# EAGLE design PIC32Schematic (EAGLE 5.12)
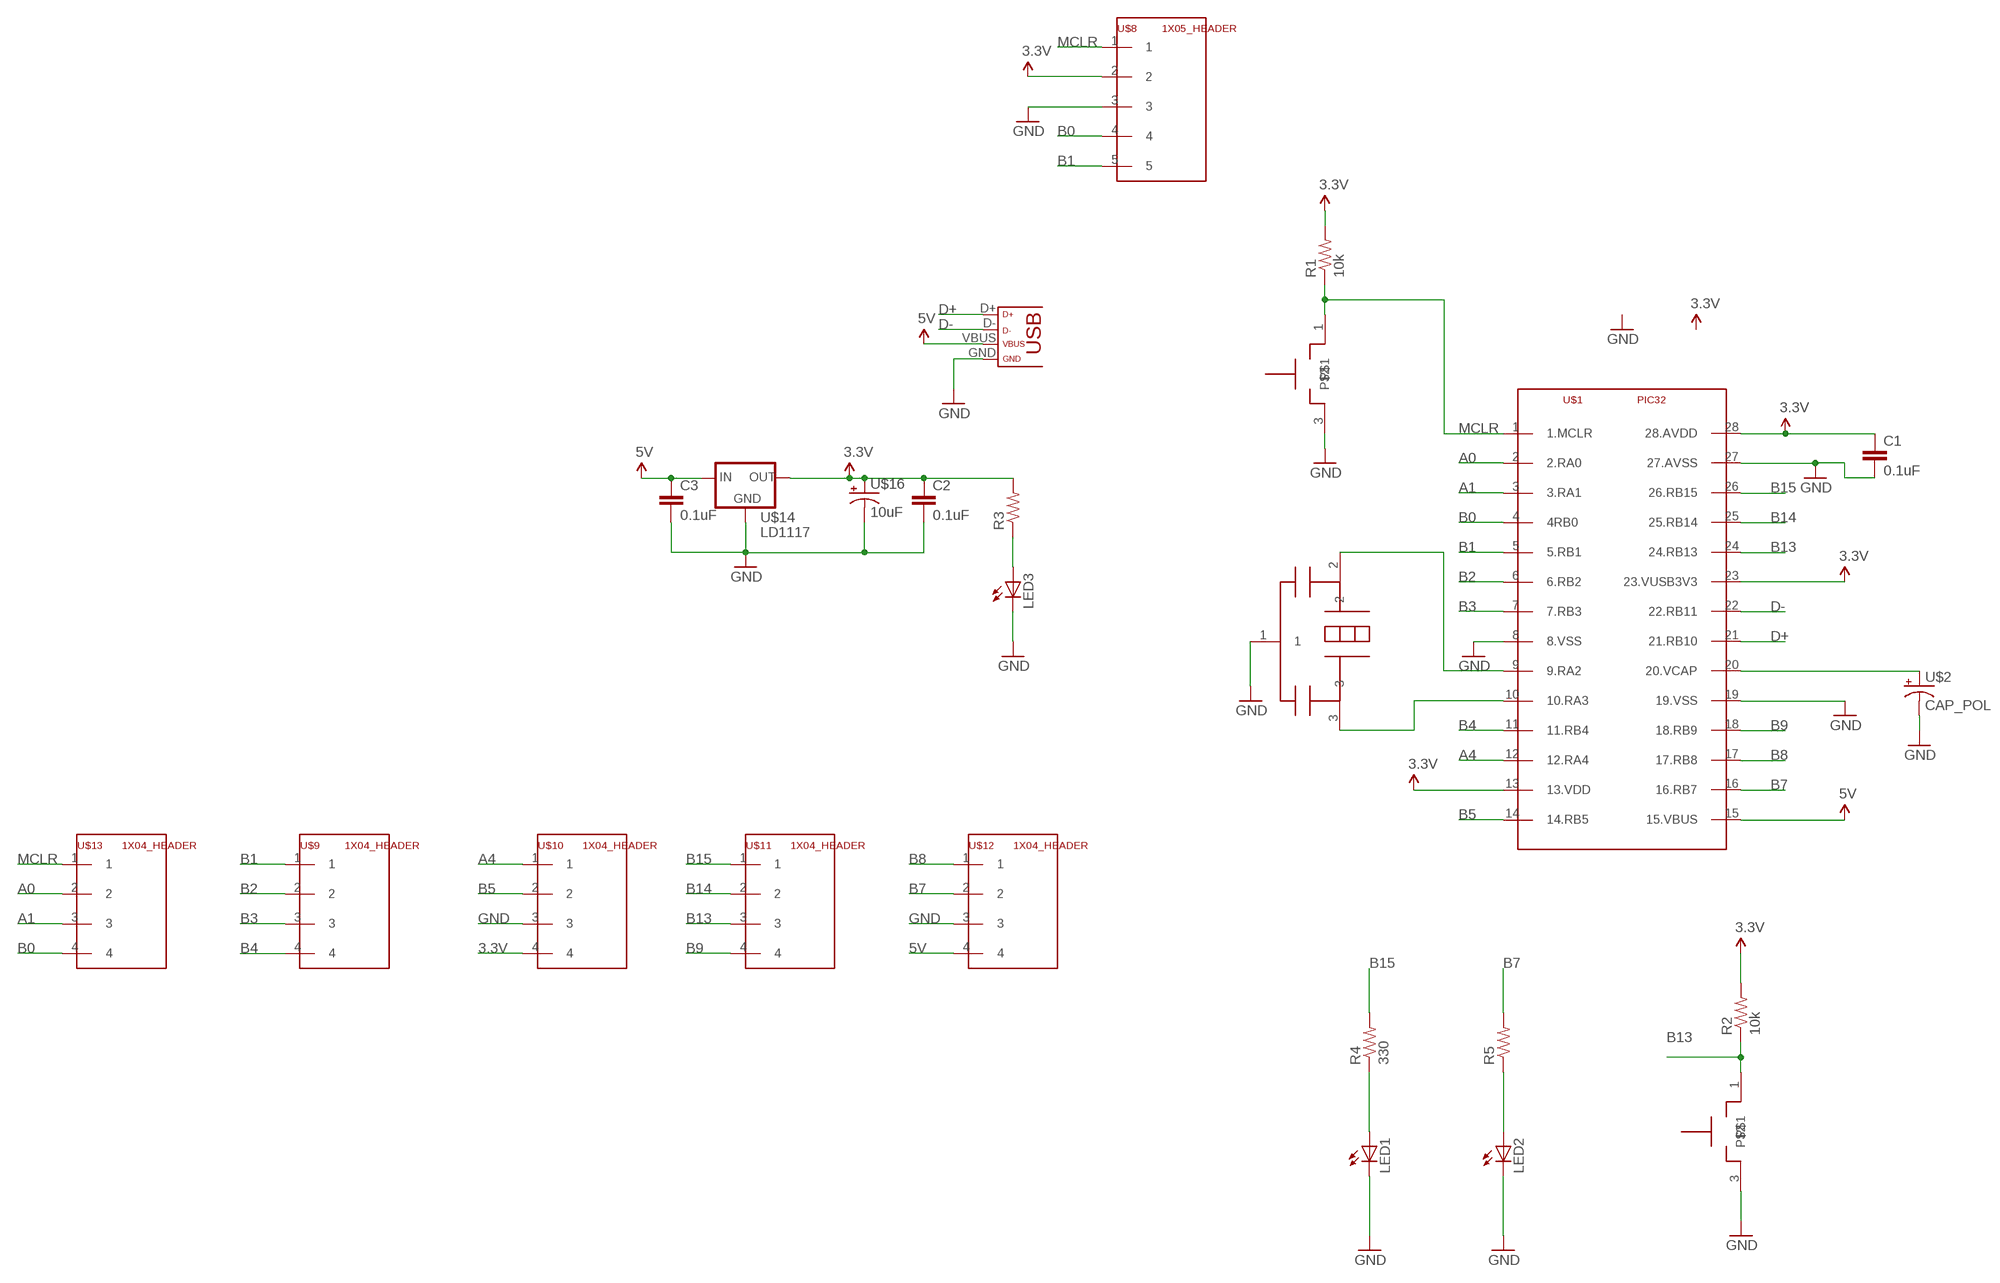
[diagram p0: schematic, sheet 1]

## Parts
8MHZ  RESONATER  [1X03]
C1  0.1uF  C-EU025-024X044  [C025-024X044]
C2  0.1uF  C-EU025-024X044  [C025-024X044]
C3  0.1uF  C-EU025-024X044  [C025-024X044]
LED1  LED3MM  [LED3MM]
LED2  LED3MM  [LED3MM]
LED3  LED3MM  [LED3MM]
R1  10k  R-US_0204/7  [0204/7]
R2  10k  R-US_0204/7  [0204/7]
R3  R-US_0204/7  [0204/7]
R4  330  R-US_0204/7  [0204/7]
R5  R-US_0204/7  [0204/7]
RESET  PUSHBUTTON  [1X03]
U$1  PIC32  [DIL28-3]
U$2  CAP_POL  [CAP_POL_D]
U$5  PUSHBUTTON  [1X03]
U$6  USB  [USB-MINIB]
U$8  1X05_HEADER  [1X05]
U$9  1X04_HEADER  [1X04]
U$10  1X04_HEADER  [1X04]
U$11  1X04_HEADER  [1X04]
U$12  1X04_HEADER  [1X04]
U$13  1X04_HEADER  [1X04]
U$14  LD1117  [TO220]
U$16  10uF  CAP_POL  [CAP_POL_D]

## Nets
3.3V: C1.1 C2.1 R1.2 R2.2 R3.2 U$1.13(13.VDD) U$1.23(23.VUSB3V3) U$1.28(28.AVDD) U$8.2 U$10.4 U$14.2(OUT) U$16.1(+)
5V: C3.1 U$1.15(15.VBUS) U$6.VBUS U$12.4 U$14.3(IN)
A0: U$1.2(2.RA0) U$13.2
A1: U$1.3(3.RA1) U$13.3
A4: U$1.12(12.RA4) U$10.1
B0: U$1.4(4RB0) U$8.4 U$13.4
B1: U$1.5(5.RB1) U$8.5 U$9.1
B2: U$1.6(6.RB2) U$9.2
B3: U$1.7(7.RB3) U$9.3
B4: U$1.11(11.RB4) U$9.4
B5: U$1.14(14.RB5) U$10.2
B7: R5.2 U$1.16(16.RB7) U$12.2
B8: U$1.17(17.RB8) U$12.1
B9: U$1.18(18.RB9) U$11.4
B13: R2.1 U$1.24(24.RB13) U$5.1 U$11.3
B14: U$1.25(25.RB14) U$11.2
B15: R4.2 U$1.26(26.RB15) U$11.1
D+: U$1.21(21.RB10) U$6.D+
D-: U$1.22(22.RB11) U$6.D-
GND: 8MHZ.1 C1.2 C2.2 C3.2 LED1.K(C) LED2.K(C) LED3.K(C) RESET.3 U$1.8(8.VSS) U$1.19(19.VSS) U$1.27(27.AVSS) U$2.2(-) U$5.3 U$6.GND U$8.3 U$10.3 U$12.3 U$14.1(GND) U$16.2(-)
MCLR: R1.1 RESET.1 U$1.1(1.MCLR) U$8.1 U$13.1
N$6: U$1.20(20.VCAP) U$2.1(+)
N$13: 8MHZ.3 U$1.10(10.RA3)
N$14: 8MHZ.2 U$1.9(9.RA2)
N$23: LED2.A R5.1
N$24: LED1.A R4.1
N$51: LED3.A R3.1

## Library data of the parts
8MHZ = ME433:RESONATER
C1-C3 = ME433:C-EU: CAPACITOR, European symbol
LED1-LED3 = ME433:LED: LED OSRAM: - CHIPLED LG R971, LG N971, LY N971, LG Q971, LY Q971, LO R971, LY R971 LH N974, LH R974 LS Q976, LO Q976, LY Q976 LO Q996 - Hyper CHIPLED LW Q18S LB Q993, LB Q99A, LB R99A - SideLED LS A670, LO A670, LY A670, LG A670, LP A670 LB A673, LV A673, LT A673, LW A673 LH A674 LY A675 LS A676, LA A676, LO A676, LY A676, LW A676 LS A679, LY A679, LG A679 - Hyper Micro SIDELED® LS Y876, LA Y876, LO Y876, LY Y876 LT Y87S - SmartLED LW L88C, LW L88S LB L89C, LB L89S, LG L890 LS L89K, LO L89K, LY L89K LS L896, LA L896, LO L896, LY L896 - TOPLED LS T670, LO T670, LY T670, LG T670, LP T670 LSG T670, LSP T670, LSY T670, LOP T670, LYG T670 LG T671, LOG T671, LSG T671 LB T673, LV T673, LT T673, LW T673 LH T674 LS T676, LA T676, LO T676, LY T676, LB T676, LH T676, LSB T676, LW T676 LB T67C, LV T67C, LT T67C, LS T67K, LO T67K, LY T67K, LW E67C LS E67B, LA E67B, LO E67B, LY E67B, LB E67C, LV E67C, LT E67C LW T67C LS T679, LY T679, LG T679 LS T770, LO T770, LY T770, LG T770, LP T770 LB T773, LV T773, LT T773, LW T773 LH T774 LS E675, LA E675, LY E675, LS T675 LS T776, LA T776, LO T776, LY T776, LB T776 LHGB T686 LT T68C, LB T68C - Hyper Mini TOPLED® LB M676 - Mini TOPLED Santana® LG M470 LS M47K, LO M47K, LY M47K Source: http://www.osram.convergy.de LUXEON: - LUMILED® LXK2-PW12-R00, LXK2-PW12-S00, LXK2-PW14-U00, LXK2-PW14-V00 LXK2-PM12-R00, LXK2-PM12-S00, LXK2-PM14-U00 LXK2-PE12-Q00, LXK2-PE12-R00, LXK2-PE12-S00, LXK2-PE14-T00, LXK2-PE14-U00 LXK2-PB12-K00, LXK2-PB12-L00, LXK2-PB12-M00, LXK2-PB14-N00, LXK2-PB14-P00, LXK2-PB14-Q00 LXK2-PR12-L00, LXK2-PR12-M00, LXK2-PR14-Q00, LXK2-PR14-R00 LXK2-PD12-Q00, LXK2-PD12-R00, LXK2-PD12-S00 LXK2-PH12-R00, LXK2-PH12-S00 LXK2-PL12-P00, LXK2-PL12-Q00, LXK2-PL12-R00 Source: www.luxeon.com KINGBRIGHT: KA-3528ASYC Source: www.kingbright.com
R1-R5 = ME433:R-US_: RESISTOR, American symbol
RESET U$5 = ME433:PUSHBUTTON
U$1 = ME433:PIC32
U$2 U$16 = ME433:CAP_POL
U$6 = ME433:USB
U$8 = ME433:1X05_HEADER
U$9-U$13 = ME433:1X04_HEADER
U$14 = ME433:LD1117

## Board
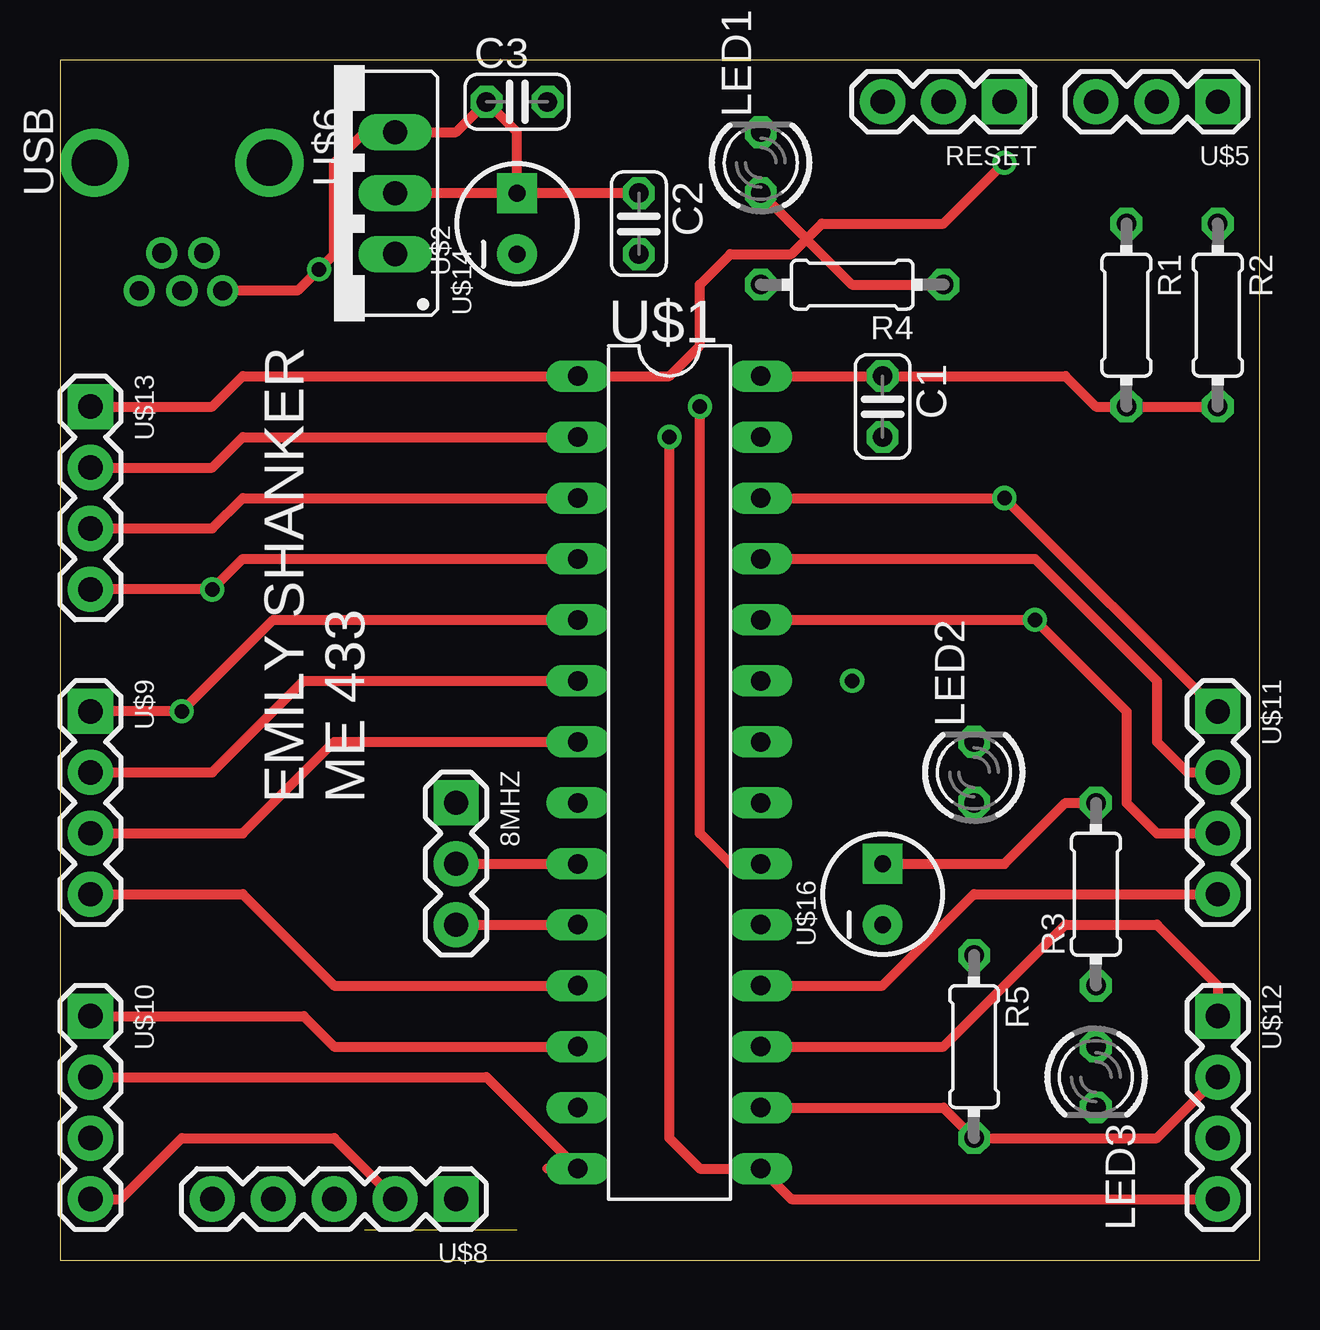
[diagram p1: board, top side]
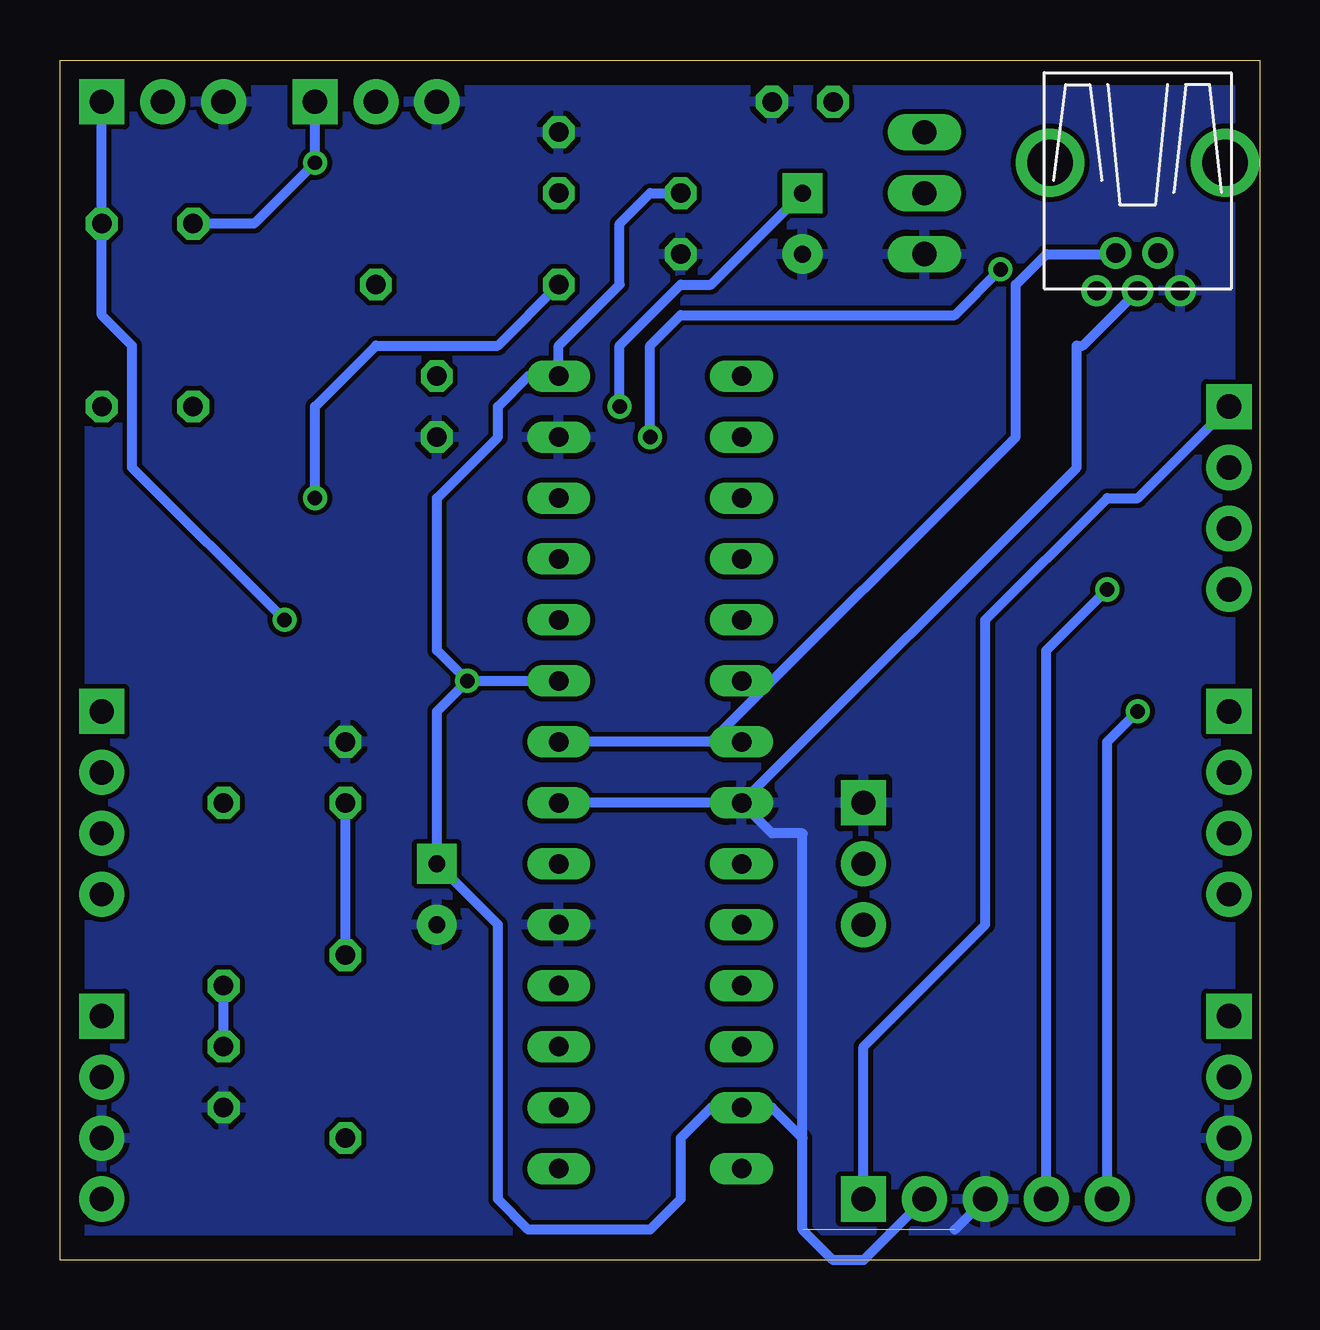
[diagram p2: board, bottom side, seen from below]

Size 50 x 50 mm. Coordinates in mm from the lower left corner, seen from the top.
Outline: 0,0 50,0 50,50 0,50 0,0
Copper layers (1*16): Top 0.035mm / dielectric 1.5mm / Bottom 0.035mm
Design rules "default": minimum track width 10mil, minimum drill 24mil, track to track 8mil, track to pad 8mil, pad to pad 8mil, via to via 8mil, smd to smd 8mil, copper to edge 40mil, drill to drill 8mil, minimum pad ring 10mil, minimum via ring 8mil, stop-mask expansion 4mil, vias tented up to drill 0mil, thermal gap 10mil

### Footprints (pad centres in the part's own frame; a part is rotated, then mirrored left to right if it is on the bottom)
1X03 = drill 1.016 pad 1.88 square: 1 0,0 | drill 1.016 pad 1.88 round: 2 2.54,0; 3 5.08,0
C025-024X044 = drill 0.813 octagon: 1 -1.27,0; 2 1.27,0
LED3MM = drill 0.813 octagon: A -1.27,0; K 1.27,0
0204/7 = drill 0.813 octagon: 1 -3.81,0; 2 3.81,0
DIL28-3 = drill 0.813 long: 1 -16.51,-3.81; 2 -13.97,-3.81; 3 -11.43,-3.81; 4 -8.89,-3.81; 5 -6.35,-3.81; 6 -3.81,-3.81; 7 -1.27,-3.81; 8 1.27,-3.81; 9 3.81,-3.81; 10 6.35,-3.81; 11 8.89,-3.81; 12 11.43,-3.81; 13 13.97,-3.81; 14 16.51,-3.81; 15 16.51,3.81; 16 13.97,3.81; 17 11.43,3.81; 18 8.89,3.81; 19 6.35,3.81; 20 3.81,3.81; 21 1.27,3.81; 22 -1.27,3.81; 23 -3.81,3.81; 24 -6.35,3.81; 25 -8.89,3.81; 26 -11.43,3.81; 27 -13.97,3.81; 28 -16.51,3.81
CAP_POL_D = drill 0.7 pad 1.651 square: 1 1.27,0 | drill 0.7 pad 1.651 round: 2 -1.27,0
USB-MINIB = drill 0.8 round: D+ 4.064,0; D- 2.489,0.914; GND 4.064,-1.778; ID 2.489,-0.838; VBUS 4.064,1.702 | drill 1.9 round: P$6 -1.27,-3.65; P$7 -1.27,3.65
1X05 = drill 1.016 pad 1.88 square: 1 0,0 | drill 1.016 pad 1.88 round: 2 2.54,0; 3 5.08,0; 4 7.62,0; 5 10.16,0
1X04 = drill 1.016 pad 1.88 square: 1 0,0 | drill 1.016 pad 1.88 round: 2 2.54,0; 3 5.08,0; 4 7.62,0
TO220 = drill 1.016 long: 1 -2.54,0; 2 0,0; 3 2.54,0

### Placement (x,y rotation side)
8MHZ  16.51,19.05 270 top
C1  34.29,35.56 270 top
C2  24.13,43.18 270 top
C3  19.05,48.26 0 top
LED1  29.21,45.72 90 top
LED2  38.1,20.32 90 top
LED3  43.18,7.62 270 top
R1  44.45,39.37 270 top
R2  48.26,39.37 270 top
R3  43.18,15.24 90 top
R4  33.02,40.64 180 top
R5  38.1,8.89 270 top
RESET  39.37,48.26 180 top
U$1  25.4,20.32 270 top
U$2  19.05,43.18 90 top
U$5  48.26,48.26 180 top
U$6  5.08,44.45 270 top
U$8  16.51,2.54 180 top
U$9  1.27,22.86 270 top
U$10  1.27,10.16 270 top
U$11  48.26,22.86 270 top
U$12  48.26,10.16 270 top
U$13  1.27,35.56 270 top
U$14  13.97,44.45 90 top
U$16  34.29,15.24 90 top

### Tracks (layer width: path | path; a pad name or v marks a point on that pad's centre or on a via)
3.3V  (via drill 0.6)
  Top 0.406: C2.1 U$14.2 | R2.2 R1.2 43.18,35.56 41.91,36.83 C1.1 U$1.28 | U$16.1 39.37,16.51 41.91,19.05 R3.2 | U$10.4 2.54,2.54 5.08,5.08 11.43,5.08 U$8.2
  Bottom 0.406: C2.1 25.4,44.45 26.67,43.18 26.67,40.64 29.21,38.1 U$1.28 30.48,36.83 31.75,35.56 31.75,34.29 34.29,31.75 34.29,25.4 v33.02,24.13 | v33.02,24.13 34.29,22.86 U$16.1 31.75,13.97 31.75,2.54 30.48,1.27 25.4,1.27 24.13,2.54 24.13,5.08 22.86,6.35 U$1.13 20.32,6.35 19.05,5.08 19.05,1.27 17.78,0 16.51,0 U$8.2 | v33.02,24.13 U$1.23
5V  (via drill 0.6)
  Top 0.406: U$12.4 30.48,2.54 U$1.15 26.67,3.81 25.4,5.08 v25.4,34.29 | U$6.VBUS 9.91,40.39 v10.79,41.27 11.43,41.91 11.43,45.72 12.7,46.99 U$14.3 16.51,46.99 C3.1
  Bottom 0.406: v25.4,34.29 25.4,38.1 24.13,39.37 12.7,39.37 v10.79,41.27
A0
  Top 0.406: U$13.2 6.35,33.02 7.62,34.29 U$1.2
A1
  Top 0.406: U$13.3 6.35,30.48 7.62,31.75 U$1.3
A4
  Top 0.406: U$10.1 10.16,10.16 11.43,8.89 U$1.12
B0  (via drill 0.6)
  Top 0.406: U$13.4 v6.35,27.94 7.62,29.21 U$1.4
  Bottom 0.406: U$8.4 8.89,25.4 v6.35,27.94
B1  (via drill 0.6)
  Top 0.406: U$9.1 v5.08,22.86 8.89,26.67 U$1.5
  Bottom 0.406: U$8.5 6.35,21.59 v5.08,22.86
B2
  Top 0.406: U$9.2 6.35,20.32 10.16,24.13 U$1.6
B3
  Top 0.406: U$9.3 7.62,17.78 11.43,21.59 U$1.7
B4
  Top 0.406: U$9.4 7.62,15.24 11.43,11.43 U$1.11
B5
  Top 0.406: 20.32,3.81 U$1.14 17.78,7.62 U$10.2
B7
  Top 0.406: U$1.16 36.83,6.35 R5.2 45.72,5.08 U$12.2
B8
  Top 0.406: U$1.17 36.83,8.89 41.91,13.97 45.72,13.97 48.26,11.43 U$12.1
B9
  Top 0.406: U$11.4 38.1,15.24 34.29,11.43 U$1.18
B13  (via drill 0.6)
  Top 0.406: U$11.3 45.72,17.78 44.45,19.05 44.45,22.86 v40.64,26.67 U$1.24
  Bottom 0.406: U$5.1 R2.1 48.26,39.37 46.99,38.1 46.99,33.02 v40.64,26.67
B14
  Top 0.406: U$11.2 46.99,20.32 45.72,21.59 45.72,24.13 40.64,29.21 U$1.25
B15  (via drill 0.6)
  Top 0.406: U$1.26 v39.37,31.75 U$11.1
  Bottom 0.406: R4.2 31.75,38.1 36.83,38.1 39.37,35.56 v39.37,31.75
D+
  Bottom 0.406: U$1.21 21.59,19.05 7.62,33.02 7.62,38.1 7.37,38.1 U$6.D+
D-
  Bottom 0.406: U$1.22 22.86,21.59 10.16,34.29 10.16,40.64 8.89,41.91 6.04,41.91 U$6.D-
GND  (1 unrouted)
  Bottom 0.406: U$8.3 12.7,1.27 | 19.05,1.27 19.05,17.78 20.32,17.78 U$1.8
  pour Bottom: 0,50.8 0,0 50.8,0 50.8,1.27 50.8,50.8
MCLR  (via drill 0.6)
  Top 0.406: U$13.1 6.35,35.56 7.62,36.83 U$1.1 25.4,36.83 26.67,38.1 26.67,40.64 27.94,41.91 30.48,41.91 31.75,43.18 36.83,43.18 v39.37,45.72
  Bottom 0.406: RESET.1 v39.37,45.72 41.91,43.18 R1.1 | U$8.1 16.51,8.89 11.43,13.97 11.43,26.67 6.35,31.75 5.08,31.75 U$13.1
N$6  (via drill 0.6)
  Top 0.406: U$2.1 19.05,46.99 17.78,48.26 | U$1.20 27.94,16.51 26.67,17.78 v26.67,35.56
  Bottom 0.406: v26.67,35.56 26.67,38.1 24.13,40.64 22.86,40.64 U$2.1
N$13
  Top 0.406: 8MHZ.3 U$1.10
N$14
  Top 0.406: 8MHZ.2 U$1.9
N$23
  Bottom 0.406: R5.1 LED2.A
N$24
  Top 0.406: LED1.A 33.02,40.64 R4.1
N$51
  Bottom 0.406: LED3.A R3.1

### Text on the board
tPlace: EMILY SHANKER | ME 433